# Altium schematic sheet GZ7_1_x-User_Interface.SchDoc
size B; SheetNumber: 9; SheetTotal: 10
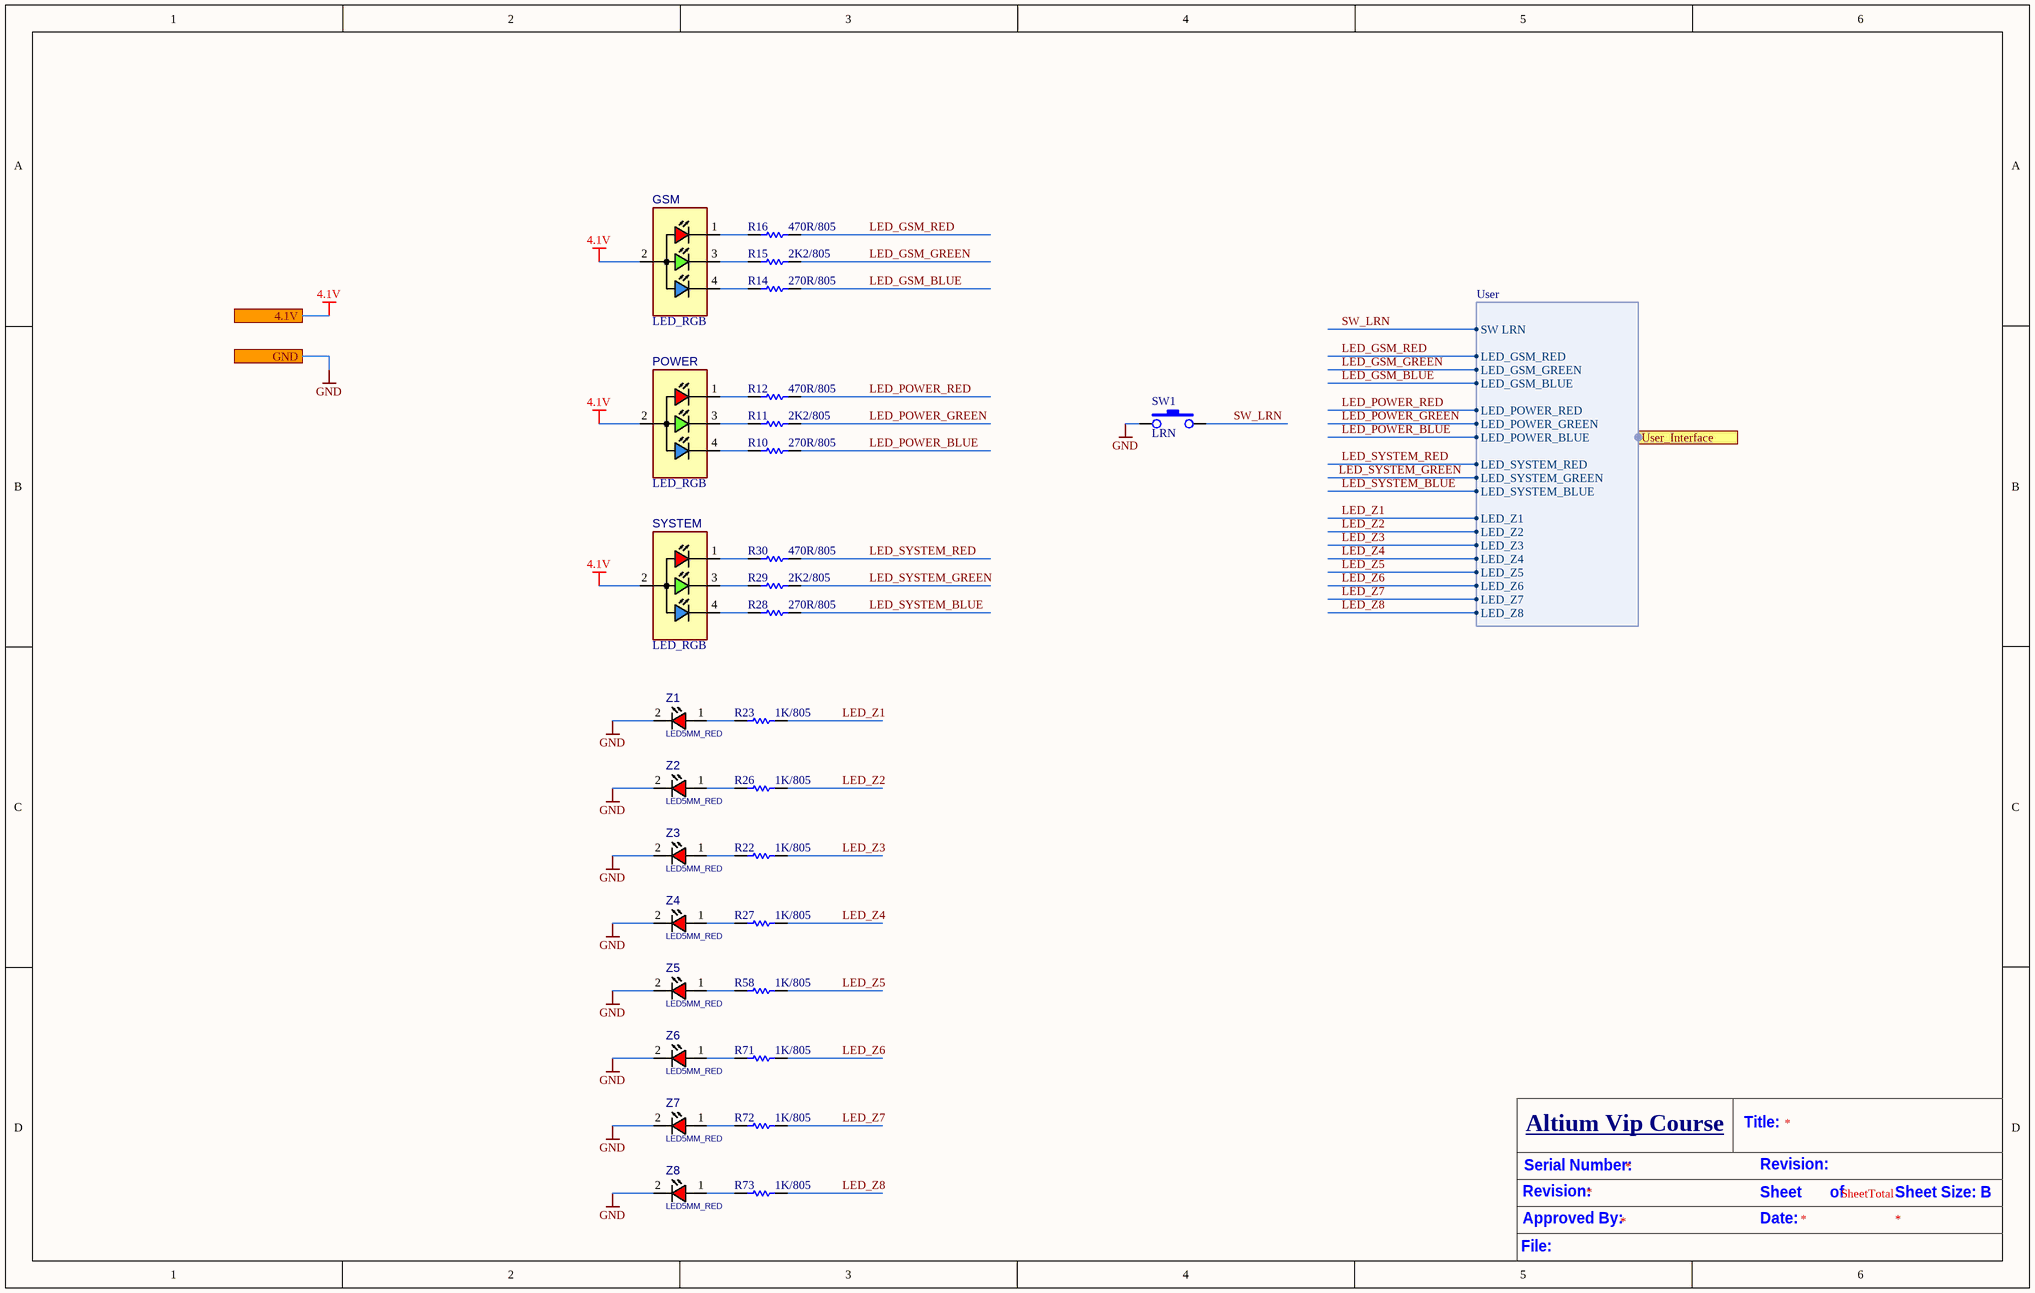
[diagram p0: GZ7_1_x-User_Interface.SchDoc]

## Parts
GSM  LED_RGB  [LED5RGB]
POWER  LED_RGB  [LED5RGB]
R10  270R/805  [my805]
R11  2K2/805  [my805]
R12  470R/805  [my805]
R14  270R/805  [my805]
R15  2K2/805  [my805]
R16  470R/805  [my805]
R22  1K/805  [my805]
R23  1K/805  [my805]
R26  1K/805  [my805]
R27  1K/805  [my805]
R28  270R/805  [my805]
R29  2K2/805  [my805]
R30  470R/805  [my805]
R58  1K/805  [my805]
R71  1K/805  [my805]
R72  1K/805  [my805]
R73  1K/805  [my805]
SW1  LRN  [SWPBS_SPST_6X3X5]
SYSTEM  LED_RGB  [LED5RGB]
Z1  LED5MM_RED  [LED_SMD_0805]
Z2  LED5MM_RED  [LED_SMD_0805]
Z3  LED5MM_RED  [LED_SMD_0805]
Z4  LED5MM_RED  [LED_SMD_0805]
Z5  LED5MM_RED  [LED_SMD_0805]
Z6  LED5MM_RED  [LED_SMD_0805]
Z7  LED5MM_RED  [LED_SMD_0805]
Z8  LED5MM_RED  [LED_SMD_0805]

## Ports
4.1V, GND, User_Interface (harness User)

## Harnesses
User: SW LRN, LED_GSM_GREEN, LED_GSM_BLUE, LED_POWER_RED, LED_POWER_GREEN, LED_POWER_BLUE, LED_SYSTEM_RED, LED_SYSTEM_GREEN, LED_SYSTEM_BLUE, LED_GSM_RED, LED_Z1, LED_Z2, LED_Z3, LED_Z4, LED_Z5, LED_Z6, LED_Z7, LED_Z8

## Nets
4.1V: GSM.2(C) POWER.2(C) SYSTEM.2(C) ; port 4.1V
GND: SW1.1 Z1.2(CATHODE) Z2.2(CATHODE) Z3.2(CATHODE) Z4.2(CATHODE) Z5.2(CATHODE) Z6.2(CATHODE) Z7.2(CATHODE) Z8.2(CATHODE) ; port GND
LED_GSM_BLUE: R14.2 ; port User_Interface.LED_GSM_BLUE
LED_GSM_GREEN: R15.2 ; port User_Interface.LED_GSM_GREEN
LED_GSM_RED: R16.2 ; port User_Interface.LED_GSM_RED
LED_POWER_BLUE: R10.2 ; port User_Interface.LED_POWER_BLUE
LED_POWER_GREEN: R11.2 ; port User_Interface.LED_POWER_GREEN
LED_POWER_RED: R12.2 ; port User_Interface.LED_POWER_RED
LED_SYSTEM_BLUE: R28.2 ; port User_Interface.LED_SYSTEM_BLUE
LED_SYSTEM_GREEN: R29.2 ; port User_Interface.LED_SYSTEM_GREEN
LED_SYSTEM_RED: R30.2 ; port User_Interface.LED_SYSTEM_RED
LED_Z1: R23.2 ; port User_Interface.LED_Z1
LED_Z2: R26.2 ; port User_Interface.LED_Z2
LED_Z3: R22.2 ; port User_Interface.LED_Z3
LED_Z4: R27.2 ; port User_Interface.LED_Z4
LED_Z5: R58.2 ; port User_Interface.LED_Z5
LED_Z6: R71.2 ; port User_Interface.LED_Z6
LED_Z7: R72.2 ; port User_Interface.LED_Z7
LED_Z8: R73.2 ; port User_Interface.LED_Z8
SW_LRN: SW1.2 ; port User_Interface.SW LRN
NetGSM_1: GSM.1(RED) R16.1
NetGSM_3: GSM.3(GRN) R15.1
NetGSM_4: GSM.4(BLU) R14.1
NetPOWER_1: POWER.1(RED) R12.1
NetPOWER_3: POWER.3(GRN) R11.1
NetPOWER_4: POWER.4(BLU) R10.1
NetR22_1: R22.1 Z3.1(ANODE)
NetR23_1: R23.1 Z1.1(ANODE)
NetR26_1: R26.1 Z2.1(ANODE)
NetR27_1: R27.1 Z4.1(ANODE)
NetR28_1: R28.1 SYSTEM.4(BLU)
NetR29_1: R29.1 SYSTEM.3(GRN)
NetR30_1: R30.1 SYSTEM.1(RED)
NetR58_1: R58.1 Z5.1(ANODE)
NetR71_1: R71.1 Z6.1(ANODE)
NetR72_1: R72.1 Z7.1(ANODE)
NetR73_1: R73.1 Z8.1(ANODE)

## Notes on the sheet
- Serial Number:
- Altium Vip Course
- Title:
- Revision:
- Approved By:
- Date:
- Sheet       of
- SheetTotal
- Sheet Size: B
- File:

## Library data of the parts
GSM POWER SYSTEM = LED_THD_5MM_RGB_CA: LED, THD, 5MM, RGB COMMON CATHODE; MANF_P#: YSL-R596CR3G4B5C-C10; MANF: CHINA YOUNG; DESC: DESCRIPTION; ASSEMBLY: ASSEMBLY; PRICE: PRICE; VALUE: LED_RGB
R10-R12 R14-R16 R22 R23 R26-R30 R58 R71-R73 = RES 1206 0.25W: RES 805; Designer: Abbas Basereh; Desc.: RES SMD 1206; Data: 16-12-2016
SW1 = SW-PB
Z1-Z8 = LED_THD_5MM_RED: LED, THD, 5MM, RED; DESC: DESCRIPTION; MANF_P#: MANF_PART#; PARAM2: 2.2V; MANF: MANF; ASSEMBLY: ASSEMBLY; PRICE: PRICE; VALUE: LED5MM_RED